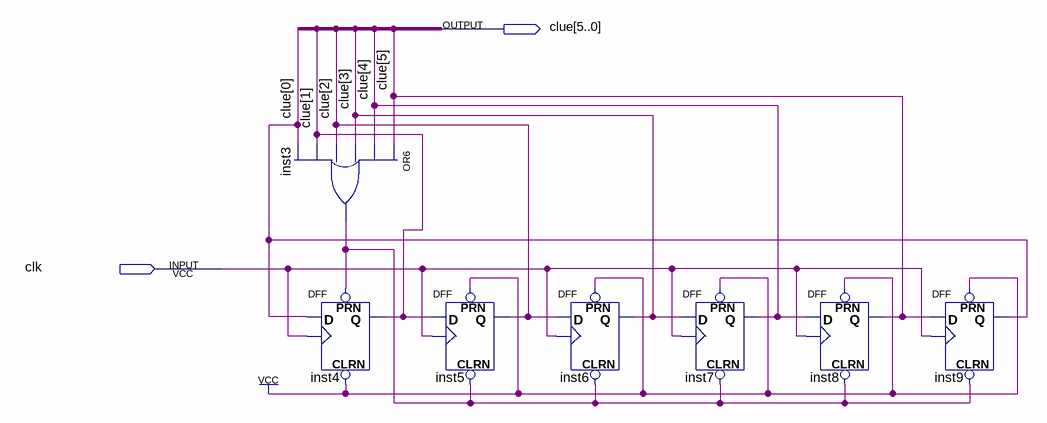
[diagram p0: schematic sheet]
// Quartus schematic clueGenerator.bdf as structural Verilog: 7 symbols, 2 pins
module clueGenerator (
  input  clk,
  output [5:0] clue
);

  wire inst3_out;

  or inst3 (inst3_out, clue[5], clue[4], clue[3], clue[2], clue[1], clue[0]);
  DFF inst4 (.CLRN(1'b1), .CLK(clk), .D(clue[0]), .PRN(inst3_out), .Q(clue[1]));
  DFF inst5 (.CLRN(inst3_out), .CLK(clk), .D(clue[1]), .PRN(1'b1), .Q(clue[2]));
  DFF inst6 (.CLRN(inst3_out), .CLK(clk), .D(clue[2]), .PRN(1'b1), .Q(clue[3]));
  DFF inst7 (.CLRN(inst3_out), .CLK(clk), .D(clue[3]), .PRN(1'b1), .Q(clue[4]));
  DFF inst8 (.CLRN(inst3_out), .CLK(clk), .D(clue[4]), .PRN(1'b1), .Q(clue[5]));
  DFF inst9 (.CLRN(inst3_out), .CLK(clk), .D(clue[5]), .PRN(1'b1), .Q(clue[0]));
endmodule
